# Altium schematic sheet WPL1321B(V1.0).SchDoc: WPL1321B(V1.0)
size A2; Revision: V1.0; PageSetup: Record=PageOptions|CenterHorizontal=True|CenterVertical=True|PrintScale=1.01|XCorrection=1.00|YCorrection=1.00|PrintKind=1|BorderSize=5000000|LeftOffset=0|BottomOffset=0|Orientation=2|PaperLength=1000|PaperWidth=1000|Scale=100|PaperSource=7|PrintQuality=600|MediaType=1|DitherType=10|PaperKind=A3|PrintScaleMode=1
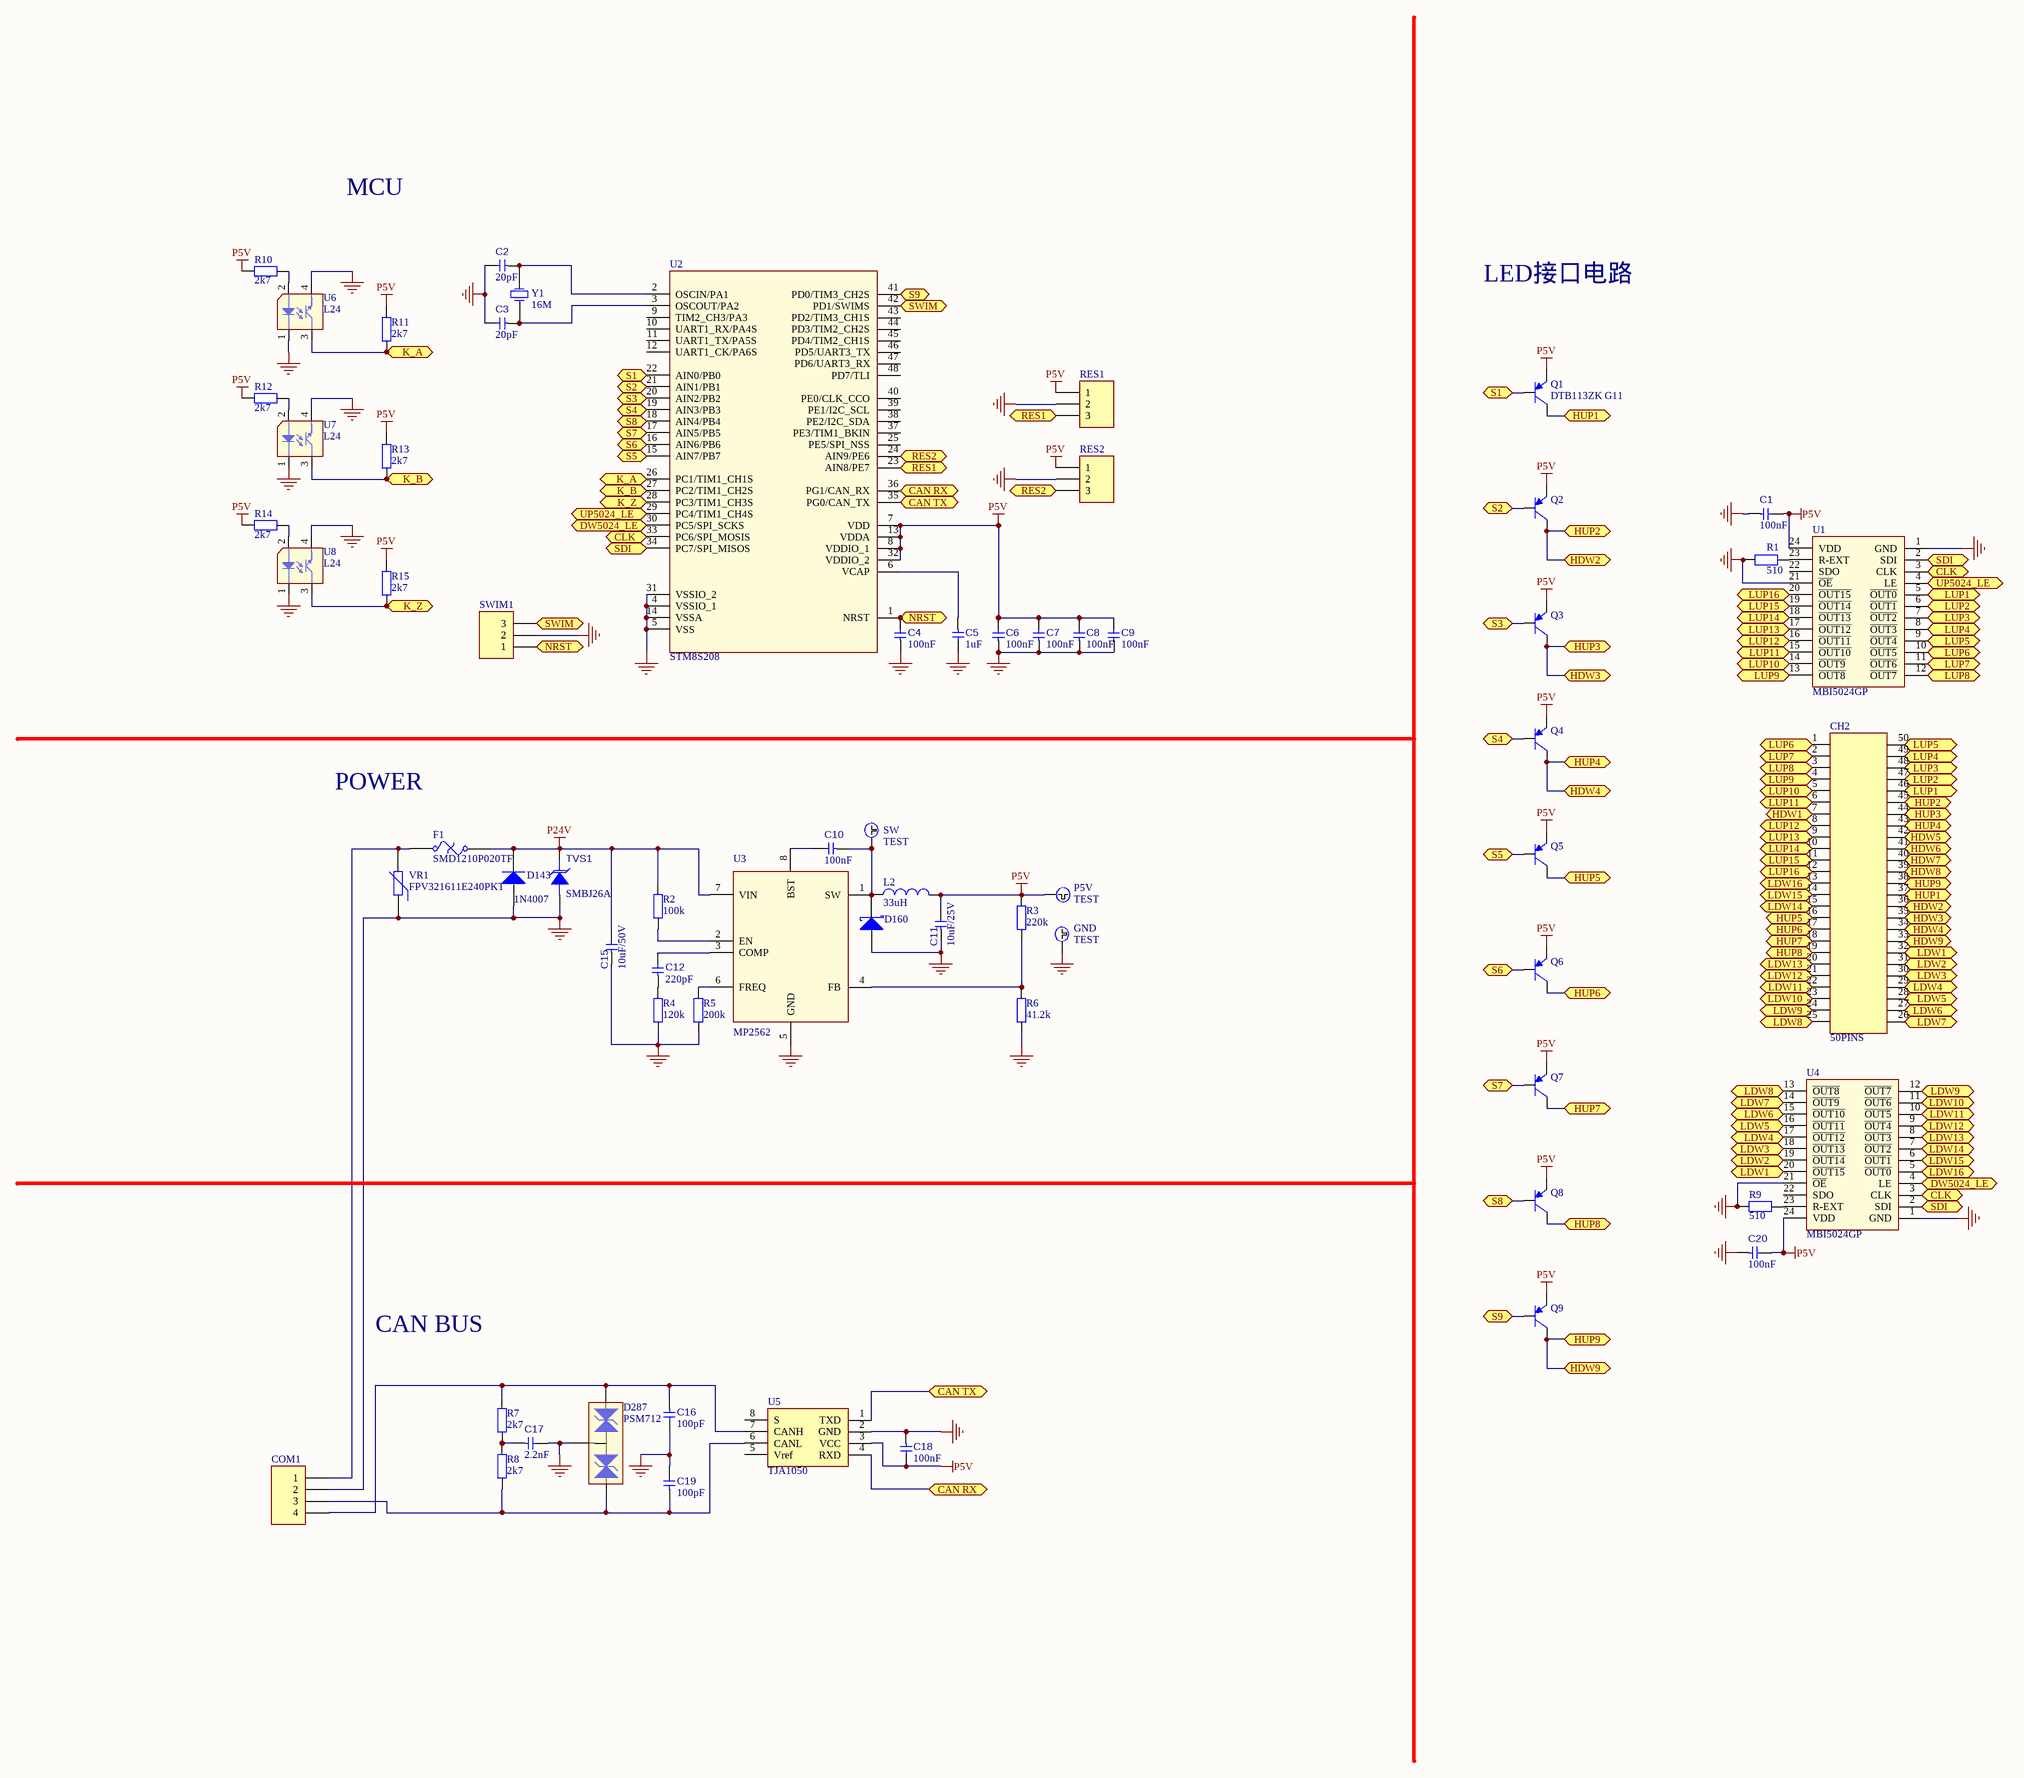
[diagram p0: WPL1321B(V1.0).SchDoc]

## Parts
C1  100nF  [CAPC1005L]
C2  20pF  [CAPC1005L]
C3  20pF  [CAPC1005L]
C4  100nF  [CAPC1005L]
C5  1uF  [CAPC1005L]
C6  100nF  [CAPC1005L]
C7  100nF  [CAPC1005L]
C8  100nF  [CAPC1005L]
C9  100nF  [CAPC1005L]
C10  100nF  [CAPC1005L]
C11  10uF/25V  [CAPC1608L]
C12  220pF  [CAPC1005L]
C15  10uF/50V  [1210]
C16  100pF  [CAPC1005L]
C17  2.2nF  [CAPC1005L]
C18  100nF  [CAPC1005L]
C19  100pF  [CAPC1005L]
C20  100nF  [CAPC1005L]
CH2  50PINS  [50PINS - youpiao]
COM1  5559-4P 4.2mm  [CPUPower]  (value not drawn)
D143  1N4007  [SMB-1]
D160  SS26  [DSO-C2/X2.3]  (value not drawn)
D287  PSM712  [SOT-23 PSM712]
F1  SMD1210P020TF  [1210]
GND  TEST  [TEST]
L2  value 33uH  [L10uH]  (hidden comment: SLF6025T-100M1R0-PF)
P5V  TEST  [TEST]
Q1  DTB113ZK G11  [318-08FL]
Q2  DTB113ZK G11  [318-08FL]  (value not drawn)
Q3  DTB113ZK G11  [318-08FL]  (value not drawn)
Q4  DTB113ZK G11  [318-08FL]  (value not drawn)
Q5  DTB113ZK G11  [318-08FL]  (value not drawn)
Q6  DTB113ZK G11  [318-08FL]  (value not drawn)
Q7  DTB113ZK G11  [318-08FL]  (value not drawn)
Q8  DTB113ZK G11  [318-08FL]  (value not drawn)
Q9  DTB113ZK G11  [318-08FL]  (value not drawn)
R1  510  [RESC1005L]
R2  100k  [RESC1005L]
R3  220k  [RESC1005L]
R4  120k  [RESC1005L]
R5  200k  [RESC1005L]
R6  41.2k  [RESC1005L]
R7  2k7  [RESC1005L]
R8  2k7  [RESC1005L]
R9  510  [RESC1005L]
R10  2k7  [RESC1005L]
R11  2k7  [RESC1005L]
R12  2k7  [RESC1005L]
R13  2k7  [RESC1005L]
R14  2k7  [RESC1005L]
R15  2k7  [RESC1005L]
RES1  3-Pads  [3-Pads-1]  (value not drawn)
RES2  3-Pads  [3-Pads-2]  (value not drawn)
SW  TEST  [TEST]
SWIM1  JST2.54*3  [2.54-3P]  (value not drawn)
TVS1  SMBJ26A  [SMB-1]
U1  MBI5024GP  [SOP24-MBI5026GP]
U2  STM8S208  [LQFP48_L]
U3  MP2562  [751-02_N]
U4  MBI5024GP  [SOP24-MBI5026GP]
U5  TJA1050  [D008_L]
U6  L24  [L24]
U7  L24  [L24]
U8  L24  [L24]
VR1  FPV321611E240PKT  [1206]
Y1  16M  [XTAL5032]

## Ports
CAN RX (bidir), CAN TX (bidir), CLK (bidir), DW5024_LE (bidir), HDW1 (bidir), HDW2 (bidir), HDW3 (bidir), HDW4 (bidir), HDW5 (bidir), HDW6 (bidir), HDW7 (bidir), HDW8 (bidir), HDW9 (bidir), HUP1 (bidir), HUP2 (bidir), HUP3 (bidir), HUP4 (bidir), HUP5 (bidir), HUP6 (bidir), HUP7 (bidir), HUP8 (bidir), HUP9 (bidir), K_A (bidir), K_B (bidir), K_Z (bidir), LDW1 (bidir), LDW2 (bidir), LDW3 (bidir), LDW4 (bidir), LDW5 (bidir), LDW6 (bidir), LDW7 (bidir), LDW8 (bidir), LDW9 (bidir), LDW10 (bidir), LDW11 (bidir), LDW12 (bidir), LDW13 (bidir), LDW14 (bidir), LDW15 (bidir), LDW16 (bidir), LUP1 (bidir), LUP2 (bidir), LUP3 (bidir), LUP4 (bidir), LUP5 (bidir), LUP6 (bidir), LUP7 (bidir), LUP8 (bidir), LUP9 (bidir), LUP10 (bidir), LUP11 (bidir), LUP12 (bidir), LUP13 (bidir), LUP14 (bidir), LUP15 (bidir), LUP16 (bidir), NRST (bidir), RES1 (bidir), RES2 (bidir), S1 (bidir), S2 (bidir), S3 (bidir), S4 (bidir), S5 (bidir), S6 (bidir), S7 (bidir), S8 (bidir), S9 (bidir), SDI (bidir), SWIM (bidir), UP5024_LE (bidir)

## Nets
GND: C1.1 C2.2 C3.2 C4.1 C5.2 C6.1 C7.1 C8.1 C9.1 C11.1 C15.1 C16.2 C17.2 C18.1 C19.2 C20.1 COM1.2 D143.1(A) D160.1(A) D287.3 GND.1 R1.1 R4.1 R5.1 R6.1 R9.1 RES1.2 RES2.2 SWIM1.2 TVS1.1 U1.1(GND) U1.21(~{OE}) U2.4(VSSIO_1) U2.5(VSS) U2.14(VSSA) U2.31(VSSIO_2) U3.5(GND) U4.1(GND) U4.21(~{OE}) U5.2(GND) U6.1 U6.4 U7.1 U7.4 U8.1 U8.4 VR1.1
P5V: C1.2 C6.2 C7.2 C8.2 C9.2 C11.2 C18.2 C20.2 L2.1 P5V.1 Q1.2(E) Q2.2(E) Q3.2(E) Q4.2(E) Q5.2(E) Q6.2(E) Q7.2(E) Q8.2(E) Q9.2(E) R3.2 R10.1 R11.2 R12.1 R13.2 R14.1 R15.2 RES1.1 RES2.1 U1.24(VDD) U2.7(VDD) U2.8(VDDIO_1) U2.13(VDDA) U2.32(VDDIO_2) U4.24(VDD) U5.3(VCC)
P24V: C15.2 D143.2(K) F1.1 R2.2 TVS1.2 U3.7(VIN)
CAN RX: U2.36(PG1/CAN_RX) U5.4(RXD) ; port CAN RX
CAN TX: U2.35(PG0/CAN_TX) U5.1(TXD) ; port CAN TX
CLK: U1.3(CLK) U2.33(PC6/SPI_MOSIS) U4.3(CLK) ; port CLK
DW5024_LE: U2.30(PC5/SPI_SCKS) U4.4(LE) ; port DW5024_LE
HDW1: CH2.7 ; port HDW1
HDW2: CH2.36 CH2.45 Q2.3(C) ; port HUP2, port HDW2
HDW3: CH2.35 CH2.44 Q3.3(C) ; port HUP3, port HDW3
HDW4: CH2.34 CH2.43 Q4.3(C) ; port HUP4, port HDW4
HDW5: CH2.42 ; port HDW5
HDW6: CH2.41 ; port HDW6
HDW7: CH2.40 ; port HDW7
HDW8: CH2.39 ; port HDW8
HDW9: CH2.33 CH2.38 Q9.3(C) ; port HUP9, port HDW9
HUP1: CH2.37 Q1.3(C) ; port HUP1
HUP5: CH2.16 Q5.3(C) ; port HUP5
HUP6: CH2.17 Q6.3(C) ; port HUP6
HUP7: CH2.18 Q7.3(C) ; port HUP7
HUP8: CH2.19 Q8.3(C) ; port HUP8
K_A: R11.1 U2.26(PC1/TIM1_CH1S) U6.3 ; port K_A
K_B: R13.1 U2.27(PC2/TIM1_CH2S) U7.3 ; port K_B
K_Z: R15.1 U2.28(PC3/TIM1_CH3S) U8.3 ; port K_Z
LDW1: CH2.32 U4.20(~{OUT15}) ; port LDW1
LDW2: CH2.31 U4.19(~{OUT14}) ; port LDW2
LDW3: CH2.30 U4.18(~{OUT13}) ; port LDW3
LDW4: CH2.29 U4.17(~{OUT12}) ; port LDW4
LDW5: CH2.28 U4.16(~{OUT11}) ; port LDW5
LDW6: CH2.27 U4.15(~{OUT10}) ; port LDW6
LDW7: CH2.26 U4.14(~{OUT9}) ; port LDW7
LDW8: CH2.25 U4.13(~{OUT8}) ; port LDW8
LDW9: CH2.24 U4.12(~{OUT7}) ; port LDW9
LDW10: CH2.23 U4.11(~{OUT6}) ; port LDW10
LDW11: CH2.22 U4.10(~{OUT5}) ; port LDW11
LDW12: CH2.21 U4.9(~{OUT4}) ; port LDW12
LDW13: CH2.20 U4.8(~{OUT3}) ; port LDW13
LDW14: CH2.15 U4.7(~{OUT2}) ; port LDW14
LDW15: CH2.14 U4.6(~{OUT1}) ; port LDW15
LDW16: CH2.13 U4.5(~{OUT0}) ; port LDW16
LUP1: CH2.46 U1.5(~{OUT0}) ; port LUP1
LUP2: CH2.47 U1.6(~{OUT1}) ; port LUP2
LUP3: CH2.48 U1.7(~{OUT2}) ; port LUP3
LUP4: CH2.49 U1.8(~{OUT3}) ; port LUP4
LUP5: CH2.50 U1.9(~{OUT4}) ; port LUP5
LUP6: CH2.1 U1.10(~{OUT5}) ; port LUP6
LUP7: CH2.2 U1.11(~{OUT6}) ; port LUP7
LUP8: CH2.3 U1.12(~{OUT7}) ; port LUP8
LUP9: CH2.4 U1.13(~{OUT8}) ; port LUP9
LUP10: CH2.5 U1.14(~{OUT9}) ; port LUP10
LUP11: CH2.6 U1.15(~{OUT10}) ; port LUP11
LUP12: CH2.8 U1.16(~{OUT11}) ; port LUP12
LUP13: CH2.9 U1.17(~{OUT12}) ; port LUP13
LUP14: CH2.10 U1.18(~{OUT13}) ; port LUP14
LUP15: CH2.11 U1.19(~{OUT14}) ; port LUP15
LUP16: CH2.12 U1.20(~{OUT15}) ; port LUP16
NRST: C4.2 SWIM1.1 U2.1(NRST) ; port NRST
RES1: RES1.3 U2.23(AIN8/PE7) ; port RES1
RES2: RES2.3 U2.24(AIN9/PE6) ; port RES2
S1: Q1.1(B) U2.22(AIN0/PB0) ; port S1
S2: Q2.1(B) U2.21(AIN1/PB1) ; port S2
S3: Q3.1(B) U2.20(AIN2/PB2) ; port S3
S4: Q4.1(B) U2.19(AIN3/PB3) ; port S4
S5: Q5.1(B) U2.15(AIN7/PB7) ; port S5
S6: Q6.1(B) U2.16(AIN6/PB6) ; port S6
S7: Q7.1(B) U2.17(AIN5/PB5) ; port S7
S8: Q8.1(B) U2.18(AIN4/PB4) ; port S8
S9: Q9.1(B) U2.41(PD0/TIM3_CH2S) ; port S9
SDI: U1.2(SDI) U2.34(PC7/SPI_MISOS) U4.2(SDI) ; port SDI
SWIM: SWIM1.3 U2.42(PD1/SWIMS) ; port SWIM
UP5024_LE: U1.4(LE) U2.29(PC4/TIM1_CH4S) ; port UP5024_LE
NetC2_1: C2.1 U2.2(OSCIN/PA1) Y1.2(OSC2)
NetC3_1: C3.1 U2.3(OSCOUT/PA2) Y1.1(OSC1)
NetC5_1: C5.1 U2.6(VCAP)
NetC10_1: C10.1 D160.2(K) L2.2 SW.1 U3.1(SW)
NetC10_2: C10.2 U3.8(BST)
NetC12_1: C12.1 R4.2
NetC12_2: C12.2 U3.3(COMP)
NetC16_1: C16.1 COM1.4 D287.1 R7.1 U5.7(CANH)
NetC17_1: C17.1 R7.2 R8.1
NetC19_1: C19.1 COM1.3 D287.2 R8.2 U5.6(CANL)
NetCOM1_1: COM1.1 F1.2 VR1.2
NetR1_2: R1.2 U1.23(R-EXT)
NetR2_1: R2.1 U3.2(EN)
NetR3_1: R3.1 R6.2 U3.4(FB)
NetR5_2: R5.2 U3.6(FREQ)
NetR9_2: R9.2 U4.23(R-EXT)
NetR10_2: R10.2 U6.2
NetR12_2: R12.2 U7.2
NetR14_2: R14.2 U8.2

Not connected (* = marked no-connect by the designer): U1 22(SDO); U2 9(TIM2_CH3/PA3) 10(UART1_RX/PA4S) 11(UART1_TX/PA5S) 12(UART1_CK/PA6S) 25(PE5/SPI_NSS) 37(PE3/TIM1_BKIN) 38(PE2/I2C_SDA) 39(PE1/I2C_SCL) 40(PE0/CLK_CCO) 43(PD2/TIM3_CH1S) 44(PD3/TIM2_CH2S) 45(PD4/TIM2_CH1S) 46(PD5/UART3_TX) 47(PD6/UART3_RX) 48(PD7/TLI); U4 22(SDO); U5 5(Vref) 8(S)

## Notes on the sheet
- MCU
- LED接口电路
- POWER
- CAN BUS

## Library data of the parts
C1-C9 C16-C20 = cap: 104 X7R; Part Number: C0015; Manufacturer1: TDK; Manufacture P/N 1: C2012X7R1H104K; PSpiceTemplate: C^@REFDES %1 %2 ?TOLERANCE|C^@REFDES| @VALUE ?IC/IC=@IC/ ?TOLERANCE|\n.model C^@REFDES CAP C=1 DEV=@TOLERANCE%|; Data Sheet: R:\hxyp\RD_DataSheet\TDK-T.pdf; PCB Footprint Location: R:\hxyp\PCB_Footprint\0805c.dra; Assembly Type: smd; RoHS: Yes
  C1 C4 C6-C9 C18 C20: Value: 100nF
  C2 C3: Value: 20pF
  C5: Value: 1uF
  C16 C19: Value: 100pF
  C17: Value: 2.2nF
C10-C12 = cap: Ceramic Capacitor; Part Number: C0015; Manufacturer1: TDK; Manufacture P/N 1: C2012X7R1H104K; PSpiceTemplate: C^@REFDES %1 %2 ?TOLERANCE|C^@REFDES?@VALUE ?IC/IC=@IC/ ?TOLERANCE|\n.model C^@REFDES CAP C=1 DEV=@TOLERANCE%|; Description: 104 X7R; Data Sheet: R:\hxyp\RD_DataSheet\TDK-T.pdf; PCB Footprint Location: R:\hxyp\PCB_Footprint\0805c.dra; Assembly Type: smd; RoHS: Yes
  C10: Value: 100nF
  C11: Value: 10uF/25V
  C12: Value: 220pF
C15 = cap: Ceramic Capacitor,C3225X5R1H106; Part Number: C0015; Manufacturer1: TDK; Manufacture P/N 1: C2012X7R1H104K; PSpiceTemplate: C^@REFDES %1 %2 ?TOLERANCE|C^@REFDES?@VALUE ?IC/IC=@IC/ ?TOLERANCE|\n.model C^@REFDES CAP C=1 DEV=@TOLERANCE%|; Description: 104 X7R; Data Sheet: R:\hxyp\RD_DataSheet\TDK-T.pdf; PCB Footprint Location: R:\hxyp\PCB_Footprint\0805c.dra; Value: 10uF/50V; Assembly Type: smd; RoHS: Yes
COM1 = Header 4: Header, 4-Pin; LatestRevisionDate: 17-Jul-2002; LatestRevisionNote: Re-released for DXP Platform.; Publisher: Altium Limited
D143 = Diode: Default Diode; Published: 8-Jun-2000; LatestRevisionDate: 17-Jul-2002; LatestRevisionNote: Re-released for DXP Platform.; PackageVersion: Sep-1996; PackageReference: SMC; Publisher: Altium Limited; Code_JEDEC: DO-214-AB
D160 = D Schottky: Schottky Diode; Published: 8-Jun-2000; LatestRevisionDate: 17-Jul-2002; LatestRevisionNote: Re-released for DXP Platform.; PackageReference: SMB; Publisher: Altium Limited; Code_JEDEC: DO-214-AA
D287 = TVS: Published: 8-Jun-2000; LatestRevisionDate: 17-Jul-2002; LatestRevisionNote: Re-released for DXP Platform.; PackageReference: DIODE-0.7; Publisher: Altium Limited
F1 = Fuse Thermal: Resettable Fuse; Published: 24-Mar-1999; LatestRevisionDate: 17-Jul-2002; LatestRevisionNote: Re-released for DXP Platform.; PackageReference: PIN-W2/E2.8; Publisher: Altium Limited
L2 = Inductor: Inductor(10uH); Code_IEC: 1005; Published: 8-Jun-2000; LatestRevisionDate: 29-May-2009; LatestRevisionNote: IPC-7351 Footprint Added.; PackageReference: 0402-A; Publisher: Altium Limited; PackageDescription: Chip Inductor; Code_JEITA: 0402
Q1-Q9 = MMBT2907LT1: Digital Transistor PNP Silicon; Published: 29-Sep-2000; LatestRevisionDate: 17-Jul-2002; LatestRevisionNote: Re-released for DXP Platform.; DatasheetVersion: 1996; PackageVersion: 1997; PackageReference: 318-08; Publisher: Altium Limited; PackageDescription: SOT-23; 3 Leads; Body 3.0 x 2.6 mm, inc. leads (LxW max); ComponentLink1Description: Manufacturer Link; ComponentLink1URL: http://www.onsemi.com/site/products/landing?taxonomyID=194
R1 R7-R15 = Res2: Resistor,1%; Published: 8-Jun-2000; LatestRevisionDate: 17-Jul-2002; LatestRevisionNote: Re-released for DXP Platform.; PackageReference: AXIAL-0.4; Publisher: Altium Limited
  R1 R9: Value: 510
  R7 R8 R10-R15: Value: 2k7
R2-R6 = Res2: Resistor, 1%; Published: 8-Jun-2000; LatestRevisionDate: 17-Jul-2002; LatestRevisionNote: Re-released for DXP Platform.; PackageReference: AXIAL-0.4; Publisher: Altium Limited
  R2: Value: 100k
  R3: Value: 220k
  R4: Value: 120k
  R5: Value: 200k
  R6: Value: 41.2k
RES1 RES2 SWIM1 = Header 3: Header, 3-Pin; LatestRevisionDate: 17-Jul-2002; LatestRevisionNote: Re-released for DXP Platform.; Publisher: Altium Limited
TVS1 = DTVS: TVS; Part Number: D0015; Manufacturer1: Diodes; Manufacture P/N 1: SMBJ6.5CA(AK); Description: TVS 6.5V; Data Sheet: R:\hxyp\RD_DataSheet\SMBJ5CA-SMBJ170CA.pdf; PCB Footprint Location: R:\hxyp\PCB_Footprint\smb.dra; Assembly Type: smd; RoHS: YES; Voltage: SMBJ26A; Operating Temperature Range: -65 to +150
U1 U4 = MBI5026GP: 16-Channel Constant Current LED Sink Driver
U2 = STM8S208_1: ST 8bit MCU
U3 = MP2562: DC-DC 1A 50V
U5 = TJA1050: CANbus tranceiver
VR1 = Res Varistor: Varistor (Voltage-Sensitive Resistor); Published: 24-Mar-1999; LatestRevisionDate: 29-May-2009; LatestRevisionNote: IPC-7351 Footprint Added.; PackageVersion: Mar-2003; PackageReference: 6-0805; Publisher: Altium Limited; PackageDescription: Chip Resistor 0805 Case Size; Code_IPC: RESC2012
Y1 = XTAL: Crystal Oscillator; Published: 8-Jun-2000; LatestRevisionDate: 17-Jul-2002; LatestRevisionNote: Re-released for DXP Platform.; PackageReference: R38; Publisher: Altium Limited